# EAGLE schematic digispark_adns2620 (EAGLE 7.5.0)
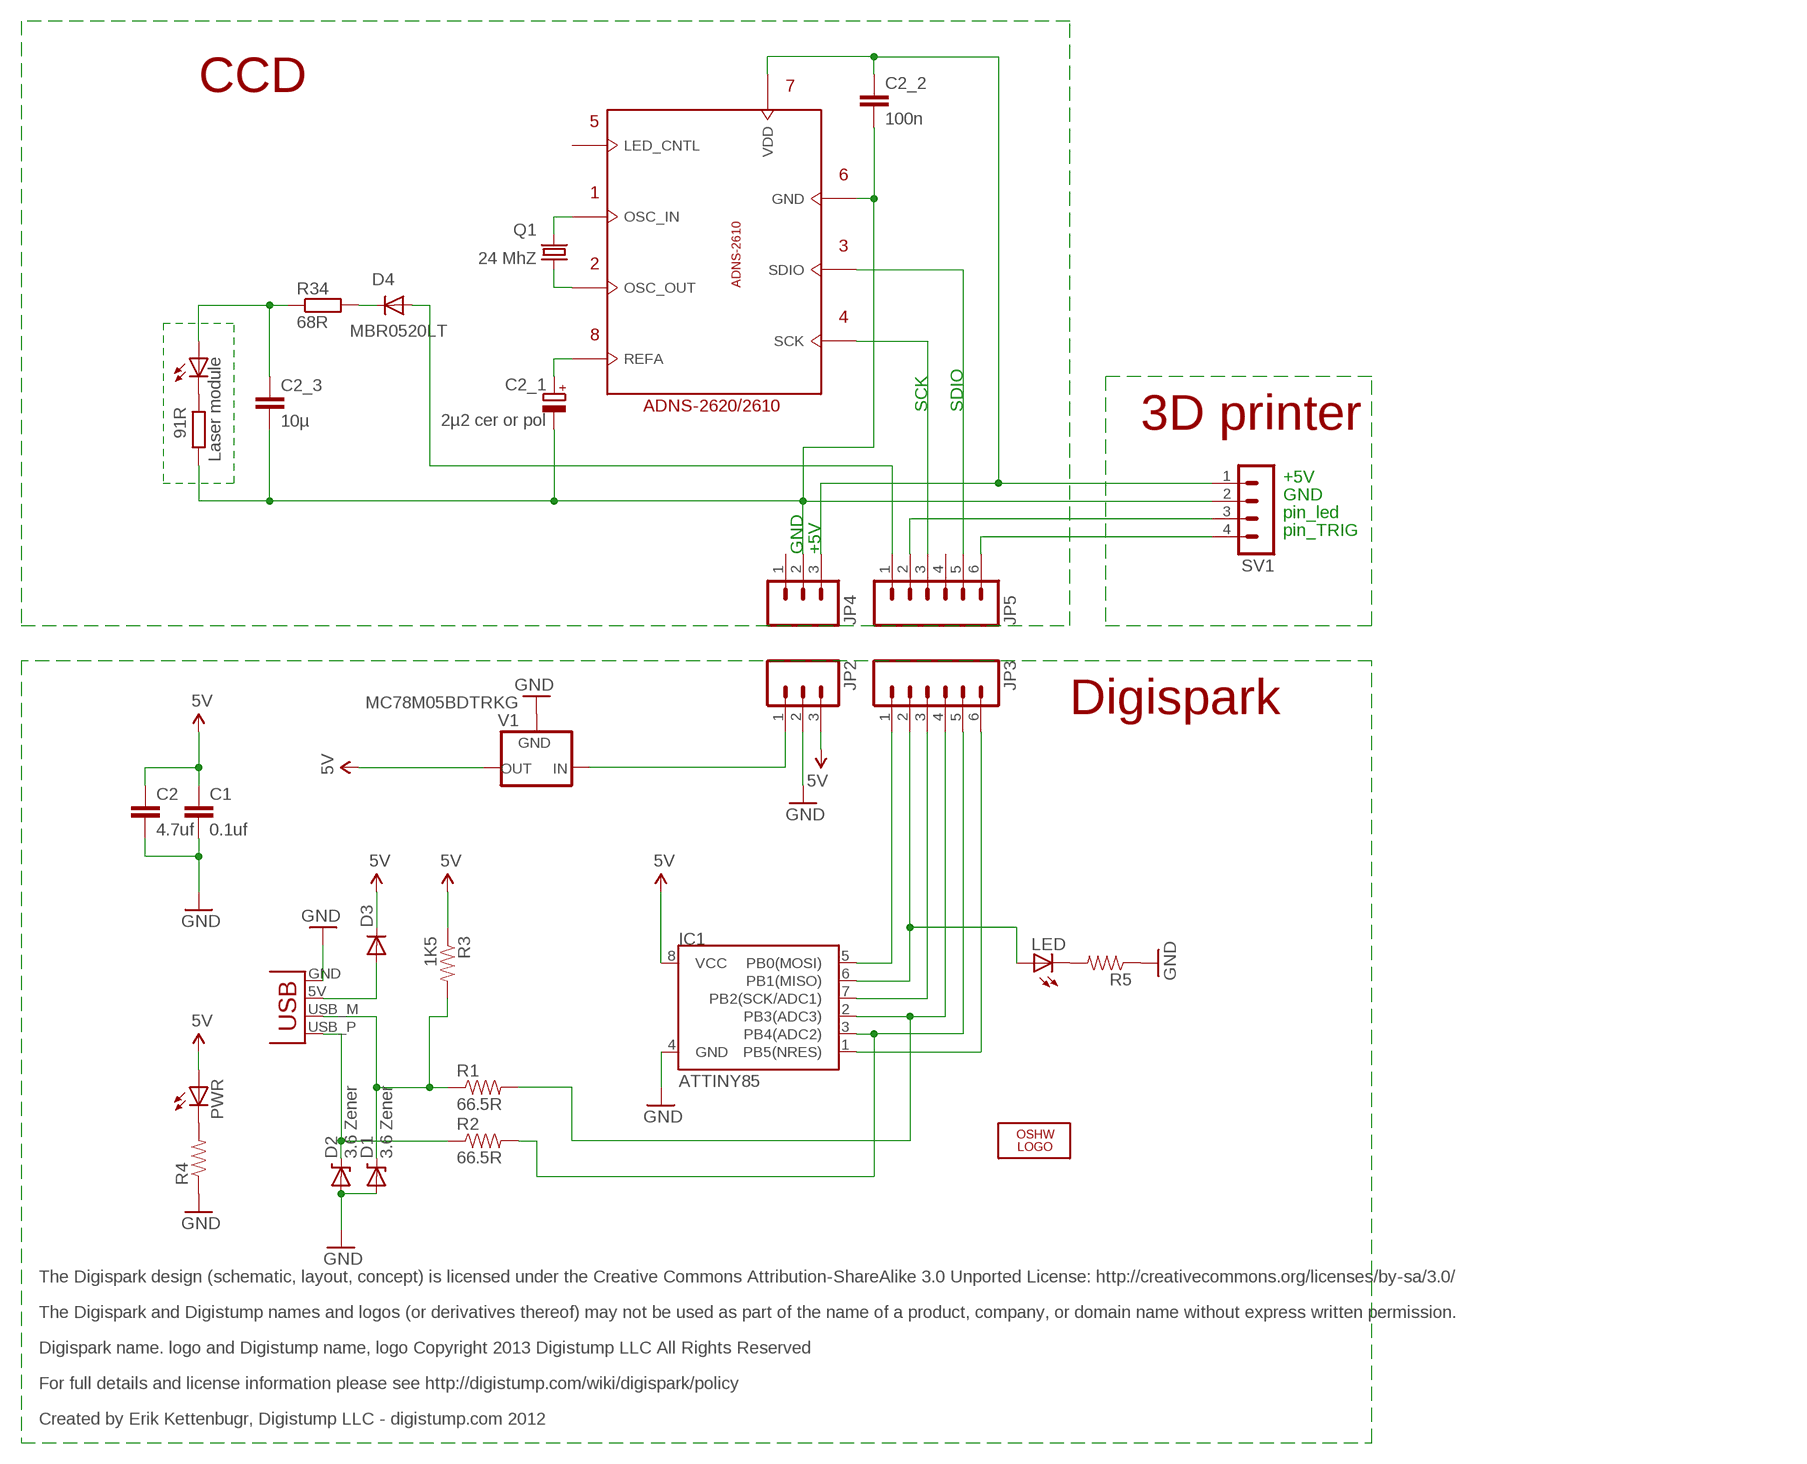
[diagram p0: schematic, sheet 1]

## Parts
C1  0.1uf  CAP0402-CAP  [0402-CAP]
C2  4.7uf  CAP0805  [0805]
C2_1  2µ2 cer or pol  CPOL-EUCT3216  [CT3216]
C2_2  100n  C-EUC0805K  [C0805K]
C2_3  10µ  C-EUC0805K  [C0805K]
D1  3.6 Zener  DIODE-ZENER-BZT52  [SOD-323]
D2  3.6 Zener  DIODE-ZENER-BZT52  [SOD-323]
D3  MBR0520LT  [SOD123]
D4  MBR0520LT  [SOD123]
IC1  ATTINY85  ATTINY45  [SO08-EIAJ]
IC2  ADNS-2620/2610  ANDS-2610DIP-8_(GORA)  [DIP-8_(GORA)]
JP2  M03PTH  [1X03]
JP3  M06SIP  [1X06]
JP4  M03PTH  [1X03]
JP5  M06SIP  [1X06]
LED  LED0603  [LED-0603]
LED1  Laser module  LED5MM  [LED5MM]
LOGO2  LOGO-OSHW-10MILX0200-NT  [OSHW_10X200_NOTEXT]
PWR  LED0603  [LED-0603]
Q1  24 MhZ  CRYTALHC49S  [HC49/S]
R1  66.5R  RESISTOR0402-RES  [0402-RES]
R2  66.5R  RESISTOR0402-RES  [0402-RES]
R3  1K5  RESISTOR0402-RES  [0402-RES]
R4  RESISTOR0402-RES  [0402-RES]
R5  RESISTOR0402-RES  [0402-RES]
R23  91R  R-EU_R1206  [R1206]
R34  68R  R-EU_R0805  [R0805]
SV1  MA04-1  [MA04-1]
V1  MC78M05BDTRKG  LP2950CDT-3.0  [DPACK]
X1  USBPCB  [USB-A-PCB]

## Nets
5V: C1.1 C2.1 D3.C IC1.8(VCC) JP2.3 PWR.A R3.1 V1.3(OUT)
GND: C1.2 C2.2 C2_1.- C2_2.2 C2_3.2 D1.2(A) D2.2(A) IC1.4(GND) IC2.6(GND) JP2.2 JP4.2 R4.1 R5.1 R23.1 SV1.2 V1.4(GND) X1.GND
N$1: IC1.2(PB3(ADC3)) JP3.4 R1.2
N$2: IC1.6(PB1(MISO)) JP3.2 LED.A
N$3: IC1.5(PB0(MOSI)) JP3.1
N$5: IC1.7(PB2(SCK/ADC1)) JP3.3
N$6: IC1.3(PB4(ADC2)) JP3.5 R2.2
N$7: JP5.2 SV1.3
N$8: IC1.1(PB5(NRES)) JP3.6
N$9: IC2.4(SCK) JP5.3
N$10: D1.1(C) R1.1 R3.2 X1.USB_M(D-)
N$11: D2.1(C) R2.1 X1.USB_P(D+)
N$12: LED.C R5.2
N$13: LED1.K(C) R23.2
N$14: JP5.6 SV1.4
N$15: JP2.1 V1.1(IN)
N$16: D3.A X1.5V(VBUS)
N$17: PWR.C R4.2
N$18: IC2.3(SDIO) JP5.5
N$22: C2_1.+ IC2.8(REFA)
N$24: C2_3.1 LED1.A R34.1
N$25: D4.C R34.2
N$26: D4.A JP5.1
N$165: IC2.1(OSC_IN) Q1.2
N$166: IC2.2(OSC_OUT) Q1.1
VDD: C2_2.1 IC2.7(VDD) JP4.3 SV1.1
Unconnected: IC2.5(LED_CNTL) JP4.1 JP5.4

## Notes on the sheet
- CCD | 7
- 5
- 6
- 1
- 3
- 2
- 4
- 8
- ADNS-2620/2610 | SCK | SDIO
- 3D printer
- +5V
- GND
- pin_led
- pin_TRIG
- GND | +5V
- Digispark
- The Digispark design (schematic, layout, concept) is licensed under the Creative Commons Attribution-ShareAlike 3.0 Unported License: http://creativecommons.org/licenses/by-sa/3.0/
- The Digispark and Digistump names and logos (or derivatives thereof) may not be used as part of the name of a product, company, or domain name without express written permission.
- Digispark name. logo and Digistump name, logo Copyright 2013 Digistump LLC All Rights Reserved
- For full details and license information please see http://digistump.com/wiki/digispark/policy
- Created by Erik Kettenbugr, Digistump LLC - digistump.com 2012

## Library data of the parts
C1 C2 = SparkFun:CAP: Capacitor Standard 0603 ceramic capacitor, and 0.1" leaded capacitor.
C2_1 = rcl:CPOL-EU: POLARIZED CAPACITOR, European symbol
C2_2 C2_3 = rcl:C-EU: CAPACITOR, European symbol
D1 D2 = SparkFun:DIODE-ZENER: Zener Diode Production Part - 8199 3.4V Zener Voltage
D3 D4 = diode:MBR0520LT: SCHOTTKY BARRIER RECTIFIER Source: http://onsemi.com .. MBR0520LT1-D.pdf
IC1 = SparkFun:ATTINY45: Atmel ATTiny45
IC2 = adns-2610:ANDS-2610
JP2 JP4 = SparkFun:M03: Header 3 Standard 3-pin 0.1" header. Use with straight break away headers (SKU : PRT-00116), right angle break away headers (PRT-00553), swiss pins (PRT-00743), machine pins (PRT-00117), and female headers (PRT-00115). Molex polarized connector foot print use with SKU : PRT-08232 with associated crimp pins and housings.
JP3 JP5 = SparkFun:M06: Header 6 Standard 6-pin 0.1" header. Use with straight break away headers (SKU : PRT-00116), right angle break away headers (PRT-00553), swiss pins (PRT-00743), machine pins (PRT-00117), and female headers (PRT-00115). Molex polarized connector foot print use with SKU : PRT-08094 with associated crimp pins and housings. NOTES ON THE VARIANTS LOCK and LOCK_LONGPADS... This footprint was designed to help hold the alignment of a through-hole component (i.e. 6-pin header) while soldering it into place. You may notice that each hole has been shifted either up or down by 0.005 of an inch from it's more standard position (which is a perfectly straight line). This slight alteration caused the pins (the squares in the middle) to touch the edges of the holes. Because they are alternating, it causes a "brace" to hold the component in place. 0.005 has proven to be the perfect amount of "off-center" position when using our standard breakaway headers. Although looks a little odd when you look at the bare footprint, once you have a header in there, the alteration is very hard to notice. Also, if you push a header all the way into place, it is covered up entirely on the bottom side. This idea of altering the position of holes to aid alignment will be further integrated into the Sparkfun Library for other footprints. It can help hold any component with 3 or more connection pins.
LED PWR = SparkFun:LED: LEDs Standard schematic elements and footprints for 5mm, 3mm, 1206, and 0603 sized LEDs. 5mm - Spark Fun Electronics SKU : COM-00529 (and others)
LED1 = led:LED: LED OSRAM: - CHIPLED LG R971, LG N971, LY N971, LG Q971, LY Q971, LO R971, LY R971 LH N974, LH R974 LS Q976, LO Q976, LY Q976 LO Q996 - Hyper CHIPLED LW Q18S LB Q993, LB Q99A, LB R99A - SideLED LS A670, LO A670, LY A670, LG A670, LP A670 LB A673, LV A673, LT A673, LW A673 LH A674 LY A675 LS A676, LA A676, LO A676, LY A676, LW A676 LS A679, LY A679, LG A679 - Hyper Micro SIDELED® LS Y876, LA Y876, LO Y876, LY Y876 LT Y87S - SmartLED LW L88C, LW L88S LB L89C, LB L89S, LG L890 LS L89K, LO L89K, LY L89K LS L896, LA L896, LO L896, LY L896 - TOPLED LS T670, LO T670, LY T670, LG T670, LP T670 LSG T670, LSP T670, LSY T670, LOP T670, LYG T670 LG T671, LOG T671, LSG T671 LB T673, LV T673, LT T673, LW T673 LH T674 LS T676, LA T676, LO T676, LY T676, LB T676, LH T676, LSB T676, LW T676 LB T67C, LV T67C, LT T67C, LS T67K, LO T67K, LY T67K, LW E67C LS E67B, LA E67B, LO E67B, LY E67B, LB E67C, LV E67C, LT E67C LW T67C LS T679, LY T679, LG T679 LS T770, LO T770, LY T770, LG T770, LP T770 LB T773, LV T773, LT T773, LW T773 LH T774 LS E675, LA E675, LY E675, LS T675 LS T776, LA T776, LO T776, LY T776, LB T776 LHGB T686 LT T68C, LB T68C - Hyper Mini TOPLED® LB M676 - Mini TOPLED Santana® LG M470 LS M47K, LO M47K, LY M47K Source: http://www.osram.convergy.de - LUMILED® LXK2-PW12-R00, LXK2-PW12-S00, LXK2-PW14-U00, LXK2-PW14-V00 LXK2-PM12-R00, LXK2-PM12-S00, LXK2-PM14-U00 LXK2-PE12-Q00, LXK2-PE12-R00, LXK2-PE12-S00, LXK2-PE14-T00, LXK2-PE14-U00 LXK2-PB12-K00, LXK2-PB12-L00, LXK2-PB12-M00, LXK2-PB14-N00, LXK2-PB14-P00, LXK2-PB14-Q00 LXK2-PR12-L00, LXK2-PR12-M00, LXK2-PR14-Q00, LXK2-PR14-R00 LXK2-PD12-Q00, LXK2-PD12-R00, LXK2-PD12-S00 LXK2-PH12-R00, LXK2-PH12-S00 LXK2-PL12-P00, LXK2-PL12-Q00, LXK2-PL12-R00 Source: www.luxeon.com
LOGO2 = logo:LOGO-OSHW-10MIL
Q1 = crystal:CRYTAL: CRYSTAL
R1-R5 = SparkFun:RESISTOR: Resistor Basic schematic elements and footprints for 0603, 1206, and PTH resistors.
R23 R34 = rcl:R-EU_: RESISTOR, European symbol
SV1 = con-lstb:MA04-1: PIN HEADER; OC_FARNELL: unknown; OC_NEWARK: unknown
V1 = v-reg:LP2950?*: Source: http://cache.national.com/ds/LP/LP2950.pdf
X1 = SparkFun:USB: USB Connectors USB-B-PTH is fully proven SKU : PRT-00139 USB-miniB is fully proven SKU : PRT-00587 USB-A-PCB is untested. USB-A-H is throughly reviewed, but untested. Spark Fun Electronics SKU : PRT-00437 USB-B-SMT is throughly reviewed, but untested. Needs silkscreen touching up. USB-A-S has not been used/tested USB-MB-H has not been used/tested